# EAGLE design lm3410-boost-flashlight-driver-17mm-mk-1.1.0 (EAGLE 6.6.0)
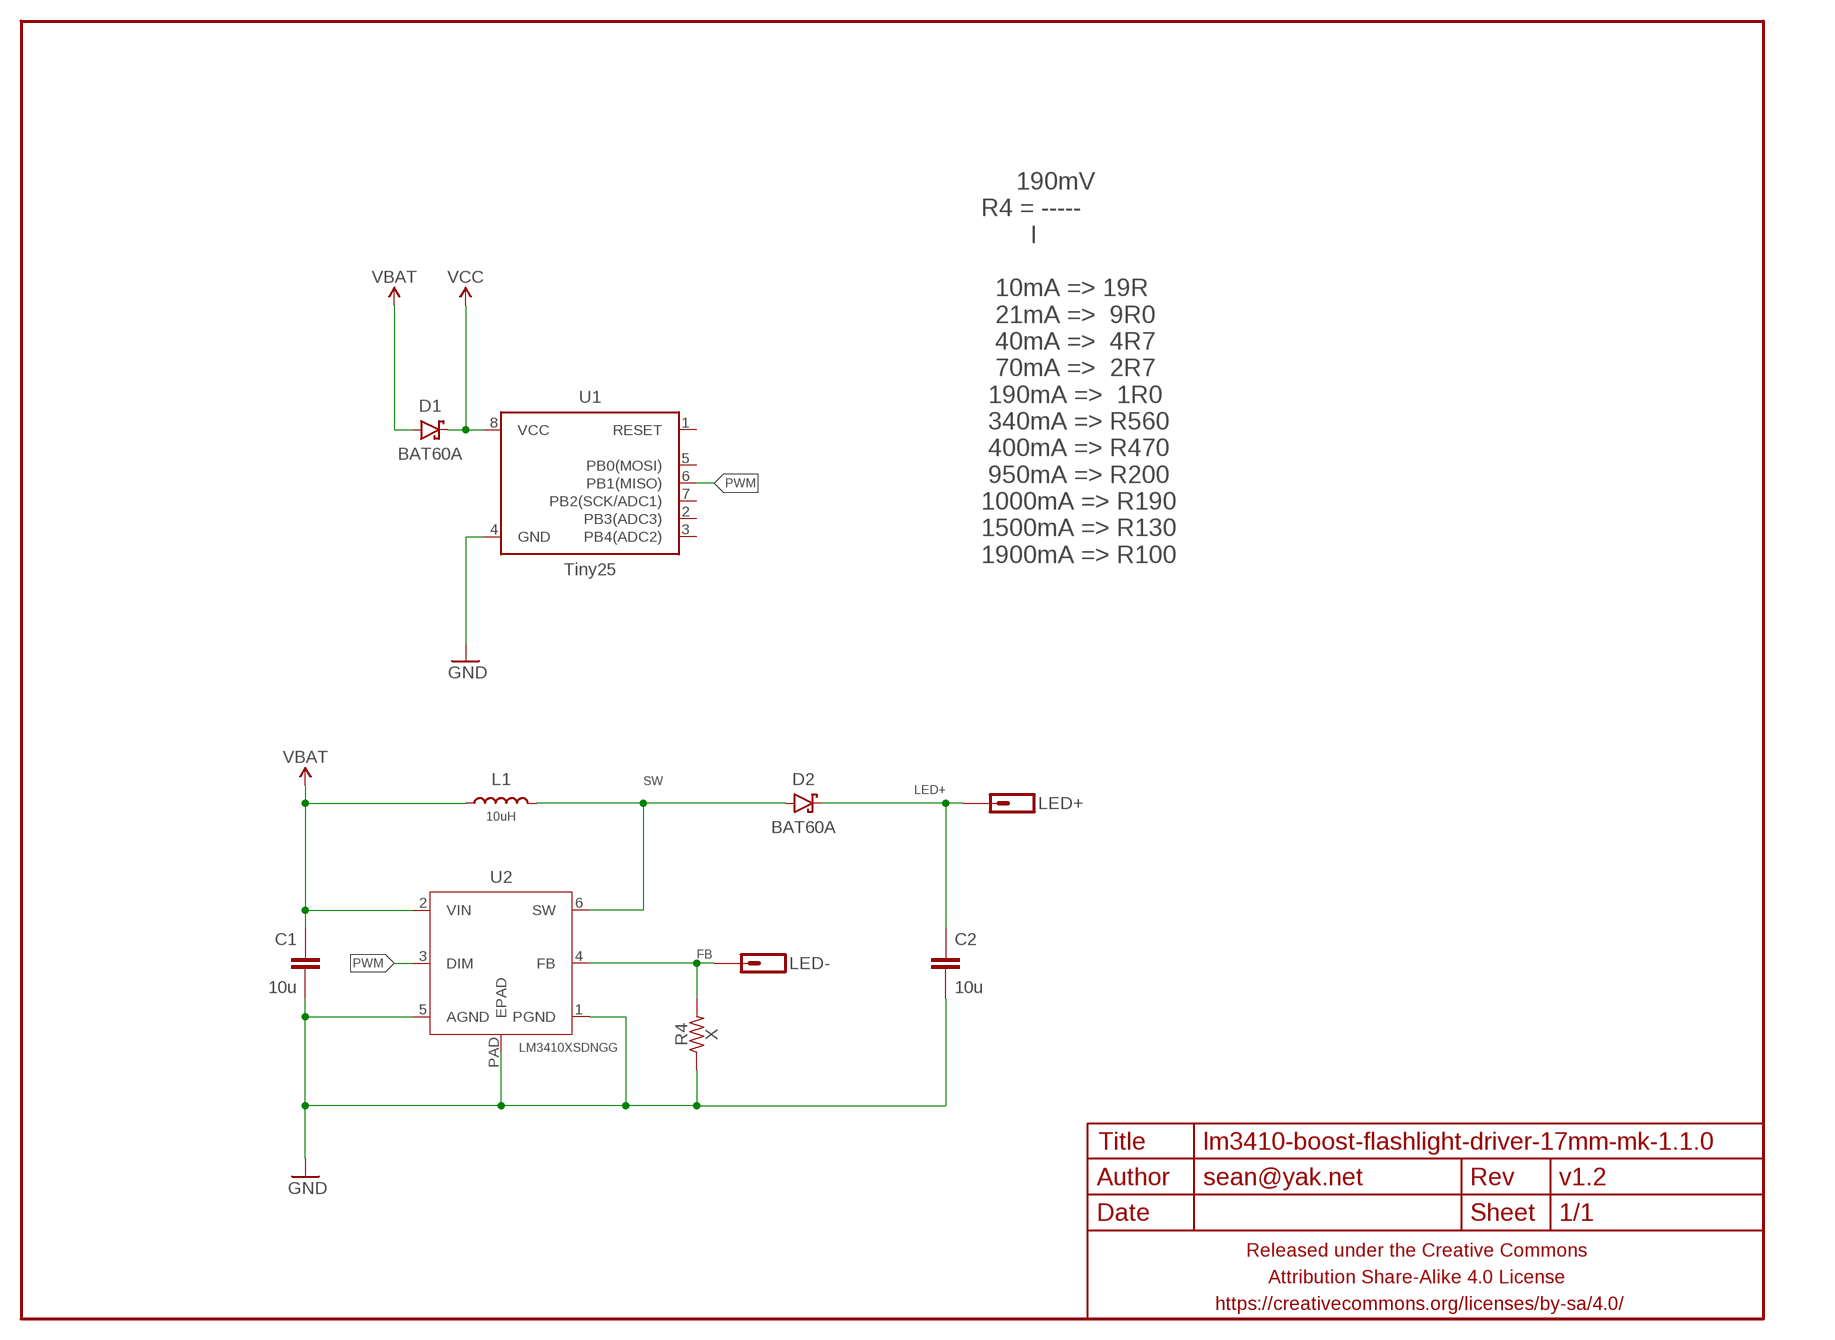
[diagram p0: schematic, sheet 1]

## Parts
C1  10u  CAPACITOR-CERAMICC0805-TIGHTER  [C0805-TIGHTER]
C2  10u  CAPACITOR-CERAMICC0805-TIGHTER  [C0805-TIGHTER]
D1  BAT60A  DIODE-SCHOTTKYSOD323  [SOD323-SCHOTTKY]
D2  BAT60A  DIODE-SCHOTTKYSOD323  [SOD323-SCHOTTKY]
FRAME1  FRAME-LETTERNO_PACKAGE  [DUMMY]
L1  10uH  INDUCTORXFL4020  [XFL4020]
LED+  M01PTH-1MM-CIR-NS  [1X01-1MM-CIR-NS]
LED-  M01PTH-1MM-CIR-NS  [1X01-1MM-CIR-NS]
R4  X  RESISTORR0805-TIGHTER  [R0805-TIGHTER]
U1  Tiny25  ATTINY45TINY25-SOICN-NARROWER  [SO08-SKINNYPADS]
U2  LM3410XSDNGG  [DFN300X300X80-7N]

## Nets
FB: LED-.1 R4.2 U2.4(FB)
GND: C1.2 C2.2 R4.1 U1.4(GND) U2.1(PGND) U2.5(AGND) U2.PAD(EPAD)
LED+: C2.1 D2.C LED+.1
PWM: U1.6(PB1(MISO)) U2.3(DIM)
SW: D2.A L1.P$2 U2.6(SW)
VBAT: C1.1 D1.A L1.P$1 U2.2(VIN)
VCC: D1.C U1.8(VCC)
Unconnected: U1.1(RESET) U1.2(PB3(ADC3)) U1.3(PB4(ADC2)) U1.5(PB0(MOSI)) U1.7(PB2(SCK/ADC1))

## Notes on the sheet
- 190mV
  R4 = -----
         I
  
    10mA => 19R
    21mA =>  9R0
    40mA =>  4R7
    70mA =>  2R7
   190mA =>  1R0
   340mA => R560
   400mA => R470
   950mA => R200
  1000mA => R190
  1500mA => R130
  1900mA => R100

## Library data of the parts
C1 C2 = a_parts:CAPACITOR-CERAMIC: CAPACITOR, European symbol
D1 D2 = a_parts:DIODE-SCHOTTKY: Schottky diodes in SFE's production catalog BAT20J 1A 23V 0.62Vf RB751 120mA 40V 0.37Vf PMEG4005EJ 0.5A 40V 0.42Vf MBRA140 1A 40V 0.5Vf B340A 3A 40V SMA
FRAME1 = a_parts:FRAME-LETTER: Schematic Frame Standard 8.5x11 US Letter frame; DESIGNER: sean@yak.net; VERSION: v1.2
L1 = a_parts:INDUCTOR: Inductors Basic Inductor/Choke - 0603 and 1206. Footprints are not proven and vary greatly between part numbers. SRN6045- 33uH, 20% 1.4A SDR0403-560KL - 56uH, 10%, 500mA RMS/740mA peak
LED+ LED- = a_parts:M01: Header 1 Standard 1-pin 0.1" header. Use with straight break away headers (SKU : PRT-00116), right angle break away headers (PRT-00553), swiss pins (PRT-00743), machine pins (PRT-00117), and female headers (PRT-00115).
R4 = a_parts:RESISTOR: RESISTOR, American symbol
U1 = a_parts:ATTINY45: Atmel 8-pin 2/4/8kB flash uC
U2 = a_parts:LM3410XSD: Constant Current Boost and SEPIC LED Driver; MPN: LM3410XSD; OC_FARNELL: -; OC_NEWARK: 11N9218; PACKAGE: DFN-6; SUPPLIER: National Semiconductor

## Board
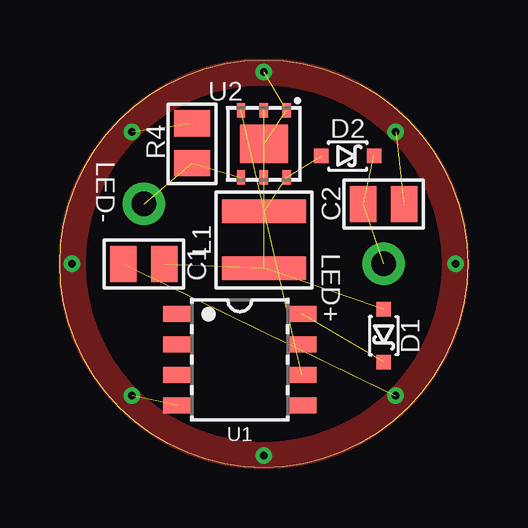
[diagram p1: board, top side]
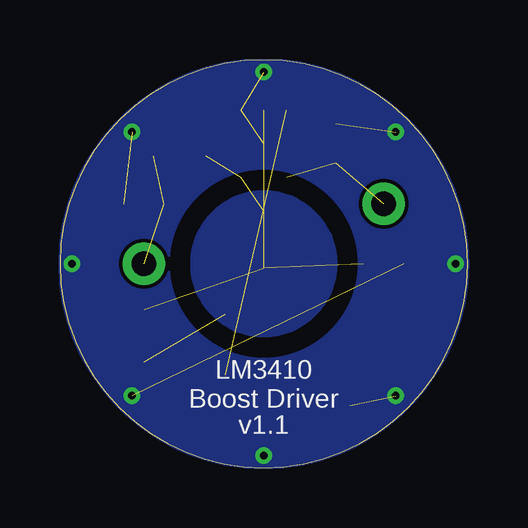
[diagram p2: board, bottom side, seen from below]

Size 17 x 17 mm. Coordinates in mm from the lower left corner, seen from the top.
Outline: 0,8.5 arc-180 17,8.5 arc-180 0,8.5
Copper layers (1*16): Top 0.0356mm / dielectric 1.5011mm / Bottom 0.0356mm
Design rules "LaenPCBOrder2 *": minimum track width 6mil, minimum drill 13mil, track to track 6mil, track to pad 6mil, pad to pad 6mil, via to via 6mil, smd to smd 6mil, copper to edge 0mil, drill to drill 6mil, minimum pad ring 7mil, minimum via ring 7mil, stop-mask expansion 3mil, vias tented up to drill 20mil, thermal gap 10mil
bRestrict: area 22.8,8.3 to 25.2,10.7; area 22.8,11.3 to 25.2,13.7; area 5,5 to 12,12

### Footprints (pad centres in the part's own frame; a part is rotated, then mirrored left to right if it is on the bottom)
C0805-TIGHTER = smd 1.1 x 1.5: 1 -0.85,0; 2 0.85,0
SOD323-SCHOTTKY = smd 0.6 x 0.6: A -1.1,0; C 1.1,0
XFL4020 = smd 0.98 x 3.5: P$1 -1.185,0; P$2 1.185,0
1X01-1MM-CIR-NS = drill 1.016 pad 1.778: 1 0,0
R0805-TIGHTER = smd 1.1 x 1.5: 1 -0.85,0; 2 0.8,0
SO08-SKINNYPADS = smd 0.65 x 1.2: 1 -1.905,-2.6; 2 -0.635,-2.6; 3 0.635,-2.6; 4 1.905,-2.6; 5 1.905,2.6; 6 0.635,2.6; 7 -0.635,2.6; 8 -1.905,2.6
DFN300X300X80-7N = smd 0.6 x 0.35: 1 -1.4,0.95; 2 -1.4,0; 3 -1.4,-0.95; 4 1.4,-0.95; 5 1.4,0; 6 1.4,0.95 | smd 1.6 x 2: PAD 0,0

### Placement (x,y rotation side)
C1  3.5,8.5 180 top
C2  13.5,11 0 top
D1  13.5,5.5 270 top
D2  12,13 0 top
FRAME1  0,0 0 top
L1  8.5,9.5 90 top
LED+  13.5,8.5 270 top
LED-  3.5,11 180 top
R4  5.5,13.5 270 top
U1  7.5,4.5 270 top
U2  8.5,13.5 270 top

### Tracks (layer width: path | path; a pad name or v marks a point on that pad's centre or on a via)
FB  (2 unrouted)
GND  (via drill 0.33)  (7 unrouted)
  other vias: 0.5,8.5 8.5,16.5 16.5,8.5 8.5,0.5 3,14 14,14 14,3 3,3
  pour Top (isolate 0.152, rank 6, no thermals): 0,8.5 arc90 8.5,0 arc90 17,8.5 16,8.5 arc-90 8.5,1 arc-90 1,8.5
  pour Bottom (isolate 0.152, rank 6, no thermals): 8.5,0 arc-90 0,8.5 arc-90 8.5,17 arc-90 17,8.5 arc-90
  pour Top (isolate 0.152, rank 6, no thermals): 17,8.5 arc90 8.5,17 arc90 0,8.5 1,8.5 arc-90 8.5,16 arc-90 16,8.5
LED+  (2 unrouted)
PWM  (1 unrouted)
SW  (2 unrouted)
VBAT  (3 unrouted)
  pour Bottom (isolate 0.152, no thermals): 5.5,8.5 arc-180 11.5,8.5 arc-180
VCC  (1 unrouted)

### Text on the board
bPlace: LM3410 / Boost Driver